# EAGLE design Thermo_Coaster_Schematic (EAGLE 9.5.2)
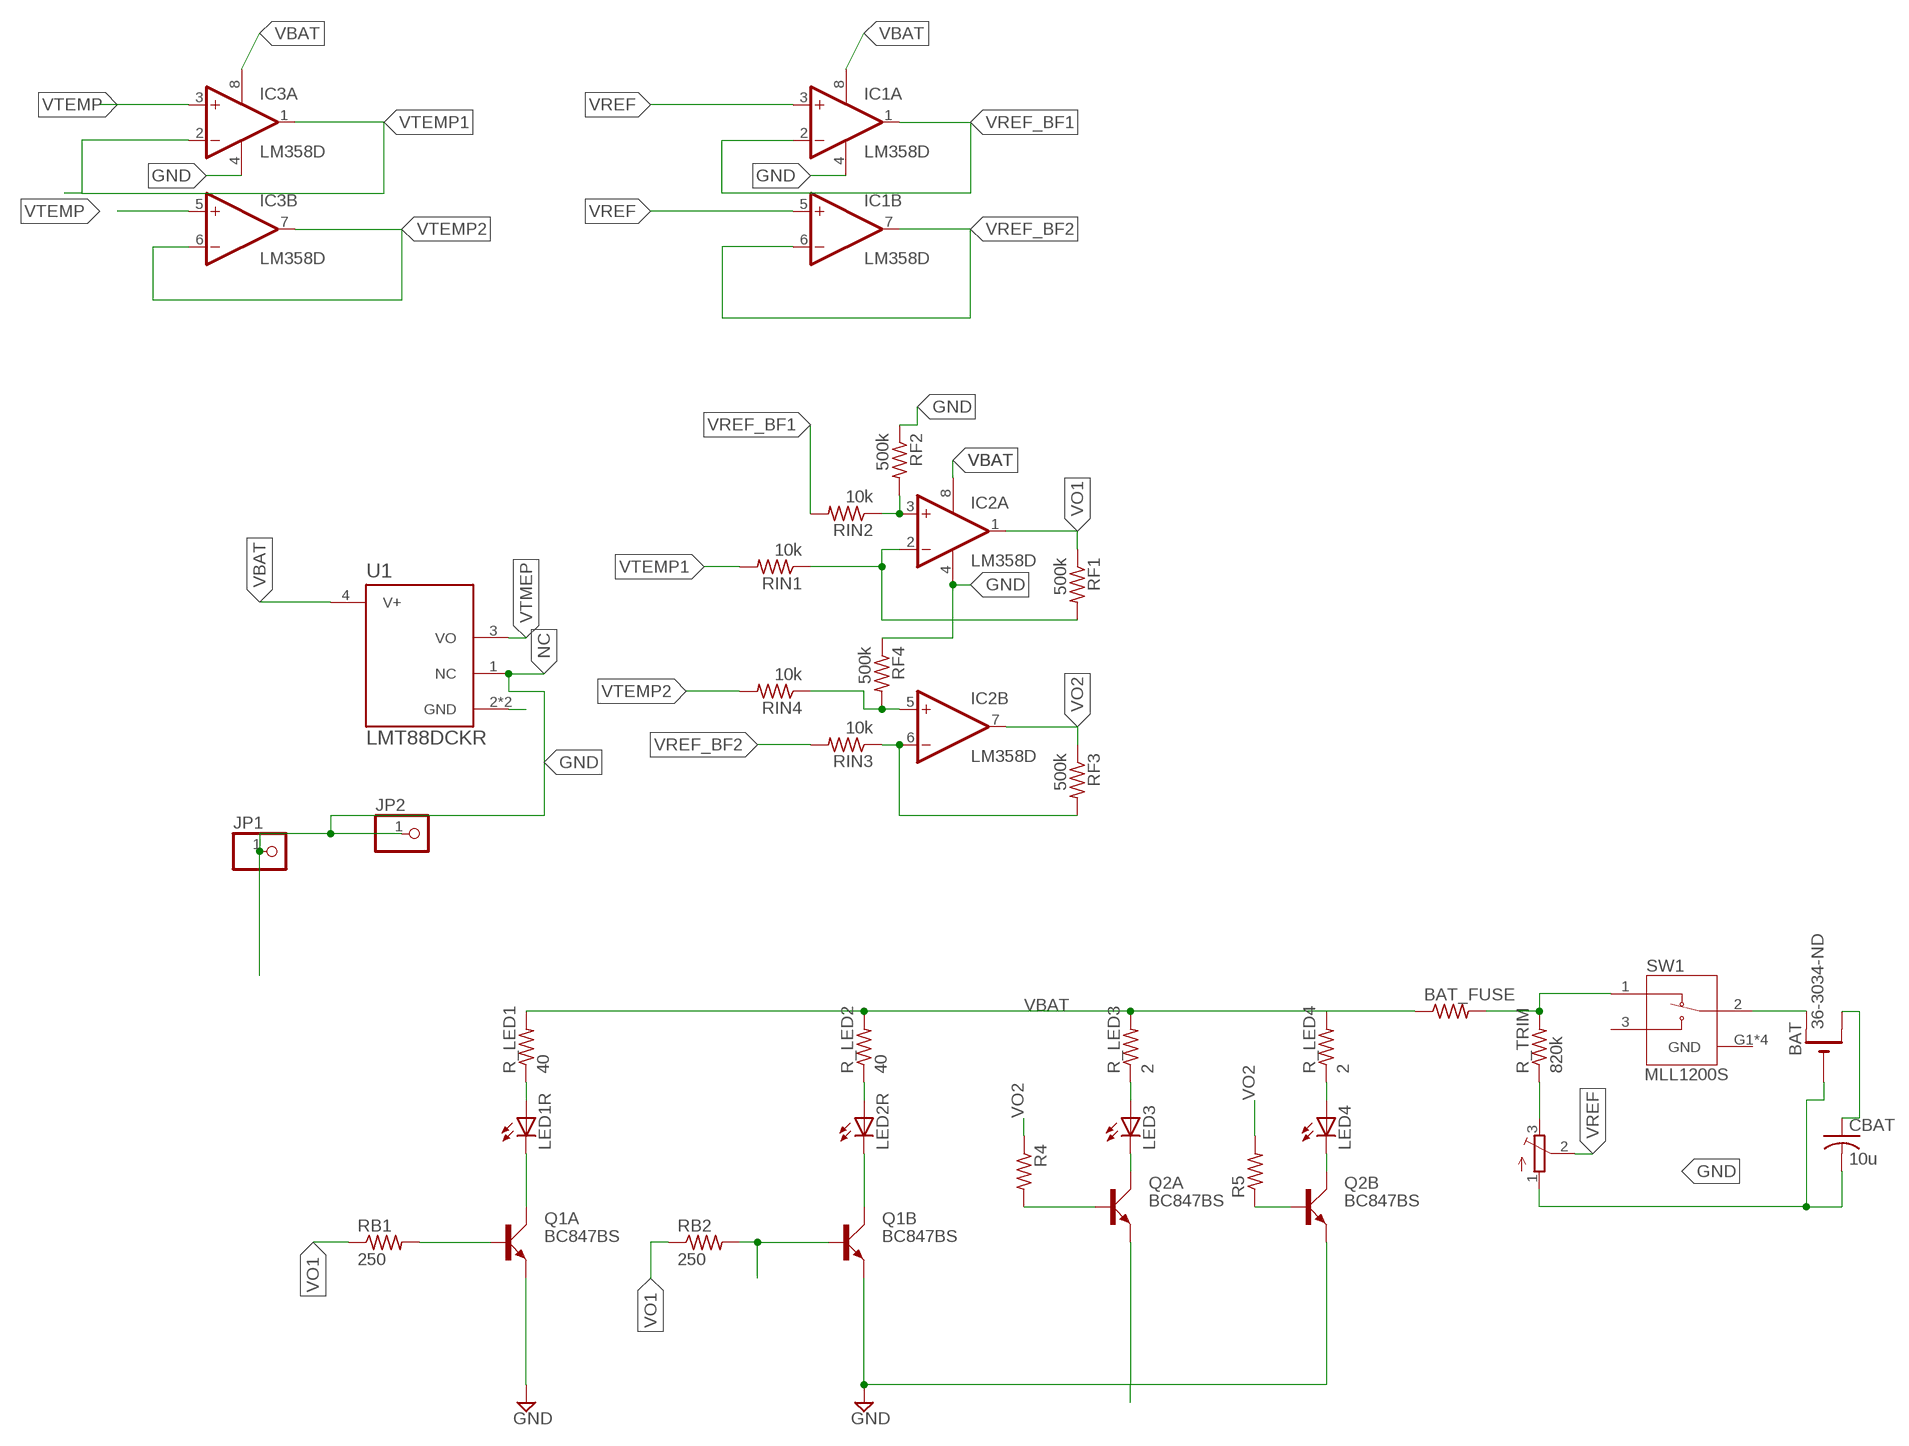
[diagram p0: schematic, sheet 1]

## Parts
BAT  CR1220SMT  [CR1220-SMD]
BAT_FUSE  R-US_R1206  [R1206]
CBAT  10u  C-USC1206  [C1206]
IC1  LM358D  [SO08]
IC2  LM358D  [SO08]
IC3  LM358D  [SO08]
JP1  PINHD-1X1  [1X01]
JP2  PINHD-1X1  [1X01]
LED1R  LEDCHIPLED_1206  [CHIPLED_1206]
LED2R  LEDCHIPLED_1206  [CHIPLED_1206]
LED3  LEDCHIPLED_1206  [CHIPLED_1206]
LED4  LEDCHIPLED_1206  [CHIPLED_1206]
Q1  BC847BS  [SOT363_PHILIPS]
Q2  BC847BS  [SOT363_PHILIPS]
R4  R-US_R0805  [R0805]
R5  R-US_R0805  [R0805]
R_LED1  40  R-US_R0805  [R0805]
R_LED2  40  R-US_R0805  [R0805]
R_LED3  2  R-US_R0805  [R0805]
R_LED4  2  R-US_R0805  [R0805]
R_TRIM  820k  R-US_R0805  [R0805]
RB1  250  R-US_R0805  [R0805]
RB2  250  R-US_R0805  [R0805]
RF1  500k  R-US_R0805  [R0805]
RF2  500k  R-US_R0805  [R0805]
RF3  500k  R-US_R0805  [R0805]
RF4  500k  R-US_R0805  [R0805]
RIN1  10k  R-US_R0805  [R0805]
RIN2  10k  R-US_R0805  [R0805]
RIN3  10k  R-US_R0805  [R0805]
RIN4  10k  R-US_R0805  [R0805]
SW1  MLL1200S  [SW_MLL1200S]
TRIM_VREF  TRIMPOTTC33X  [TC33X]
U1  LMT88DCKR  [SOT65P210X110-5N]

## Nets
GND: BAT.- CBAT.2 IC1.4(P:V-) IC2.4(P:V-) IC3.4(P:V-) Q1.1(A:E) Q1.4(B:E) Q2.1(A:E) Q2.4(B:E) RF2.1 RF4.1 TRIM_VREF.1(A) U1.2(GND) U1.5(GND)
N$1: Q1.2(A:B) RB1.2
N$2: BAT_FUSE.2 R_TRIM.2 SW1.1
N$3: LED2R.A R_LED2.1
N$4: Q1.5(B:B) RB2.2
N$5: LED1R.A R_LED1.1
N$6: LED1R.C Q1.6(A:C)
N$7: LED2R.C Q1.3(B:C)
N$8: LED3.A R_LED3.1
N$9: BAT.+$2(+1) CBAT.1
N$10: IC2.3(A:+IN) RF2.2 RIN2.1
N$11: LED4.A R_LED4.1
N$12: LED3.C Q2.6(A:C)
N$13: BAT.+$1(+) SW1.2
N$14: LED4.C Q2.3(B:C)
N$15: R_TRIM.1 TRIM_VREF.3(E)
N$16: IC2.2(A:-IN) RF1.2 RIN1.1
N$17: IC2.6(B:-IN) RF3.2 RIN3.1
N$18: IC2.5(B:+IN) RF4.2 RIN4.1
NC: JP1.1 JP2.1 U1.1(NC)
VBAT: BAT_FUSE.1 IC1.8(P:V+) IC2.8(P:V+) IC3.8(P:V+) R_LED1.2 R_LED2.2 R_LED3.2 R_LED4.2 U1.4(V+)
VO1: IC2.1(A:OUT) RB1.1 RB2.1 RF1.1
VO2: IC2.7(B:OUT) Q2.2(A:B) Q2.5(B:B) R4.1 R4.2 R5.1 R5.2 RF3.1
VREF: IC1.3(A:+IN) IC1.5(B:+IN) TRIM_VREF.2(S)
VREF_BF1: IC1.1(A:OUT) IC1.2(A:-IN) RIN2.2
VREF_BF2: IC1.6(B:-IN) IC1.7(B:OUT) RIN3.2
VTEMP: IC3.3(A:+IN) IC3.5(B:+IN)
VTEMP1: IC3.1(A:OUT) IC3.2(A:-IN) RIN1.2
VTEMP2: IC3.6(B:-IN) IC3.7(B:OUT) RIN4.2
VTMEP: U1.3(VO)
Unconnected: SW1.3

## Power pins joined to a net without a drawn wire
GND: SW1.G1(GND) SW1.G2(GND) SW1.G3(GND) SW1.G4(GND)

## Library data of the parts
BAT = adafruit:CR1220: CR1216/CR1220/CR1225 12mm 3V lithium coin cell Great for battery packup. Both SMT and THM holders. Note the THM package has the ground pads on both sides of the PCB so that the masks are the same - this reduces the cost; P#: 36-3034-ND
BAT_FUSE R4 R5 R_LED1-R_LED4 R_TRIM RB1 RB2 RF1-RF4 RIN1-RIN4 = adafruit:R-US_: RESISTOR, American symbol
CBAT = adafruit:C-US: CAPACITOR, American symbol
IC1-IC3 = linear:LM358: OP AMP also LM158; LM258; LM2904 Source: http://cache.national.com/ds/LM/LM158.pdf
JP1 JP2 = adafruit:PINHD-1X1: Pin header 1x1 for 0.1" spacing With round pins
LED1R = adafruit:LED: LED OSRAM: - CHIPLED LG R971, LG N971, LY N971, LG Q971, LY Q971, LO R971, LY R971 LH N974, LH R974 LS Q976, LO Q976, LY Q976 LO Q996 - Hyper CHIPLED LW Q18S LB Q993, LB Q99A, LB R99A - SideLED LS A670, LO A670, LY A670, LG A670, LP A670 LB A673, LV A673, LT A673, LW A673 LH A674 LY A675 LS A676, LA A676, LO A676, LY A676, LW A676 LS A679, LY A679, LG A679 - Hyper Micro SIDELED® LS Y876, LA Y876, LO Y876, LY Y876 LT Y87S - SmartLED LW L88C, LW L88S LB L89C, LB L89S, LG L890 LS L89K, LO L89K, LY L89K LS L896, LA L896, LO L896, LY L896 - TOPLED LS T670, LO T670, LY T670, LG T670, LP T670 LSG T670, LSP T670, LSY T670, LOP T670, LYG T670 LG T671, LOG T671, LSG T671 LB T673, LV T673, LT T673, LW T673 LH T674 LS T676, LA T676, LO T676, LY T676, LB T676, LH T676, LSB T676, LW T676 LB T67C, LV T67C, LT T67C, LS T67K, LO T67K, LY T67K, LW E67C LS E67B, LA E67B, LO E67B, LY E67B, LB E67C, LV E67C, LT E67C LW T67C LS T679, LY T679, LG T679 LS T770, LO T770, LY T770, LG T770, LP T770 LB T773, LV T773, LT T773, LW T773 LH T774 LS E675, LA E675, LY E675, LS T675 LS T776, LA T776, LO T776, LY T776, LB T776 LHGB T686 LT T68C, LB T68C - Hyper Mini TOPLED® LB M676 - Mini TOPLED Santana® LG M470 LS M47K, LO M47K, LY M47K Source: http://www.osram.convergy.de/; P#: QBLP615-R
LED2R = adafruit:LED: LED OSRAM: - CHIPLED LG R971, LG N971, LY N971, LG Q971, LY Q971, LO R971, LY R971 LH N974, LH R974 LS Q976, LO Q976, LY Q976 LO Q996 - Hyper CHIPLED LW Q18S LB Q993, LB Q99A, LB R99A - SideLED LS A670, LO A670, LY A670, LG A670, LP A670 LB A673, LV A673, LT A673, LW A673 LH A674 LY A675 LS A676, LA A676, LO A676, LY A676, LW A676 LS A679, LY A679, LG A679 - Hyper Micro SIDELED® LS Y876, LA Y876, LO Y876, LY Y876 LT Y87S - SmartLED LW L88C, LW L88S LB L89C, LB L89S, LG L890 LS L89K, LO L89K, LY L89K LS L896, LA L896, LO L896, LY L896 - TOPLED LS T670, LO T670, LY T670, LG T670, LP T670 LSG T670, LSP T670, LSY T670, LOP T670, LYG T670 LG T671, LOG T671, LSG T671 LB T673, LV T673, LT T673, LW T673 LH T674 LS T676, LA T676, LO T676, LY T676, LB T676, LH T676, LSB T676, LW T676 LB T67C, LV T67C, LT T67C, LS T67K, LO T67K, LY T67K, LW E67C LS E67B, LA E67B, LO E67B, LY E67B, LB E67C, LV E67C, LT E67C LW T67C LS T679, LY T679, LG T679 LS T770, LO T770, LY T770, LG T770, LP T770 LB T773, LV T773, LT T773, LW T773 LH T774 LS E675, LA E675, LY E675, LS T675 LS T776, LA T776, LO T776, LY T776, LB T776 LHGB T686 LT T68C, LB T68C - Hyper Mini TOPLED® LB M676 - Mini TOPLED Santana® LG M470 LS M47K, LO M47K, LY M47K Source: http://www.osram.convergy.de/; P#: 1516-1072-2-ND; SPICEPREFIX: D; URL: https://www.digikey.ca/en/products/detail/qt-brightek-qtb/QBLP615-IB/4814799
LED3 LED4 = adafruit:LED: LED OSRAM: - CHIPLED LG R971, LG N971, LY N971, LG Q971, LY Q971, LO R971, LY R971 LH N974, LH R974 LS Q976, LO Q976, LY Q976 LO Q996 - Hyper CHIPLED LW Q18S LB Q993, LB Q99A, LB R99A - SideLED LS A670, LO A670, LY A670, LG A670, LP A670 LB A673, LV A673, LT A673, LW A673 LH A674 LY A675 LS A676, LA A676, LO A676, LY A676, LW A676 LS A679, LY A679, LG A679 - Hyper Micro SIDELED® LS Y876, LA Y876, LO Y876, LY Y876 LT Y87S - SmartLED LW L88C, LW L88S LB L89C, LB L89S, LG L890 LS L89K, LO L89K, LY L89K LS L896, LA L896, LO L896, LY L896 - TOPLED LS T670, LO T670, LY T670, LG T670, LP T670 LSG T670, LSP T670, LSY T670, LOP T670, LYG T670 LG T671, LOG T671, LSG T671 LB T673, LV T673, LT T673, LW T673 LH T674 LS T676, LA T676, LO T676, LY T676, LB T676, LH T676, LSB T676, LW T676 LB T67C, LV T67C, LT T67C, LS T67K, LO T67K, LY T67K, LW E67C LS E67B, LA E67B, LO E67B, LY E67B, LB E67C, LV E67C, LT E67C LW T67C LS T679, LY T679, LG T679 LS T770, LO T770, LY T770, LG T770, LP T770 LB T773, LV T773, LT T773, LW T773 LH T774 LS E675, LA E675, LY E675, LS T675 LS T776, LA T776, LO T776, LY T776, LB T776 LHGB T686 LT T68C, LB T68C - Hyper Mini TOPLED® LB M676 - Mini TOPLED Santana® LG M470 LS M47K, LO M47K, LY M47K Source: http://www.osram.convergy.de/
Q1 Q2 = transistor-small-signal:BC847BS: NPN general purpose double transistor Source: http://www.farnell.com/datasheets/2466.pdf
SW1 = MLL1200S:MLL1200S: Switch Slide SPDT Side Slide 0.3A 4VDC Gull Wing SMD Box Check prices <https://pricing.snapeda.com/parts/MLL1200S/TE%20Connectivity/view-part?ref=eda>; AVAILABILITY: Good; COMMENT: 1437575-1; DESCRIPTION: Slide Switch SPDT Surface Mount, Right Angle; MF: TE Connectivity; MP: MLL1200S; PACKAGE: None; PRICE: None; PURCHASE-URL: https://pricing.snapeda.com/search/part/MLL1200S/?ref=eda
TRIM_VREF = adafruit:TRIMPOT: SMT trimmer potentiometer part number TC33X http://www.ladyada.net/library/eagle
U1 = LMT88DCKR:LMT88DCKR: ±4°C analog output temperature sensor, with -11.77mV/°C gain 5-SC70 -55 to 130 Check prices <https://pricing.snapeda.com/parts/LMT88DCKR/Texas%20Instruments/view-part?ref=eda>; AVAILABILITY: Good; DESCRIPTION: &plusmn;4&deg;C analog output temperature sensor, with -11.77mV/&deg;C gain 5-SC70 -55 to 130; MF: Texas Instruments; MP: LMT88DCKR; PACKAGE: SOT-SC70-5 Texas Instruments; PRICE: None; PURCHASE-URL: https://pricing.snapeda.com/search/part/LMT88DCKR/?ref=eda

## Net classes
0 default: width 0.002 mm, clearance 0.002 mm

## Board
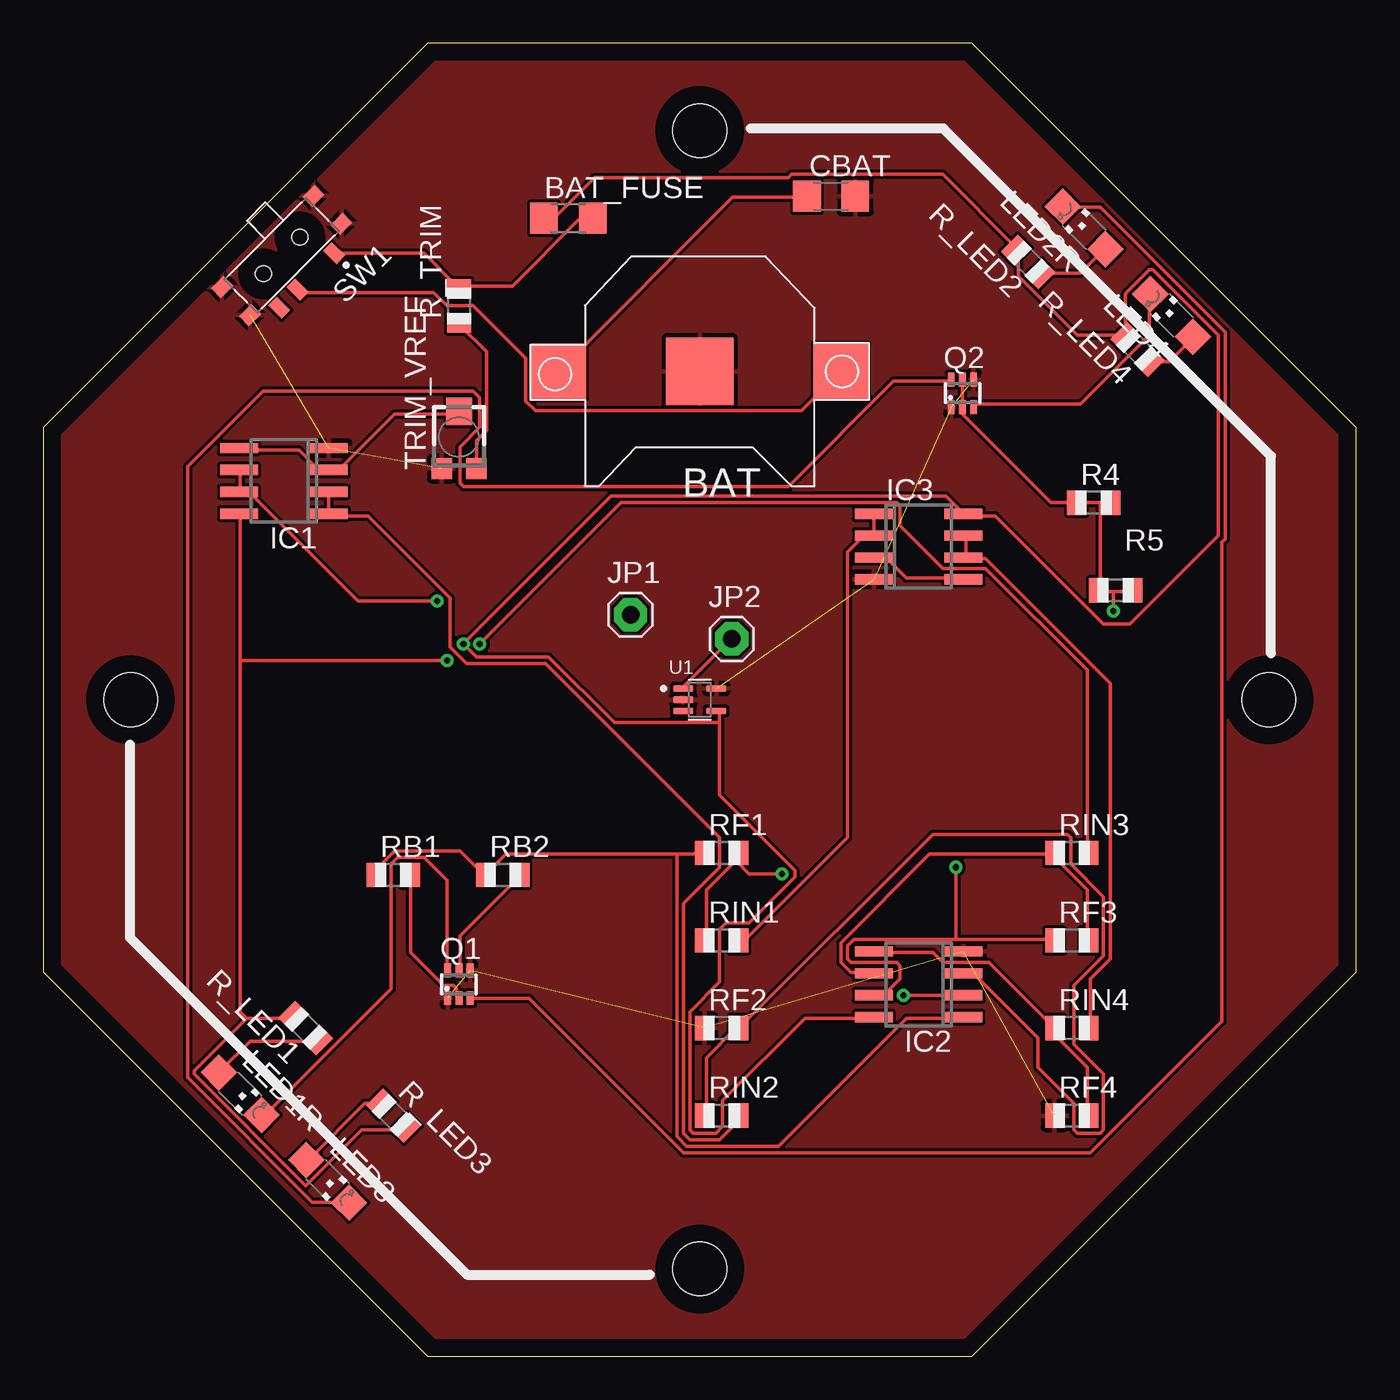
[diagram p1: board, top side]
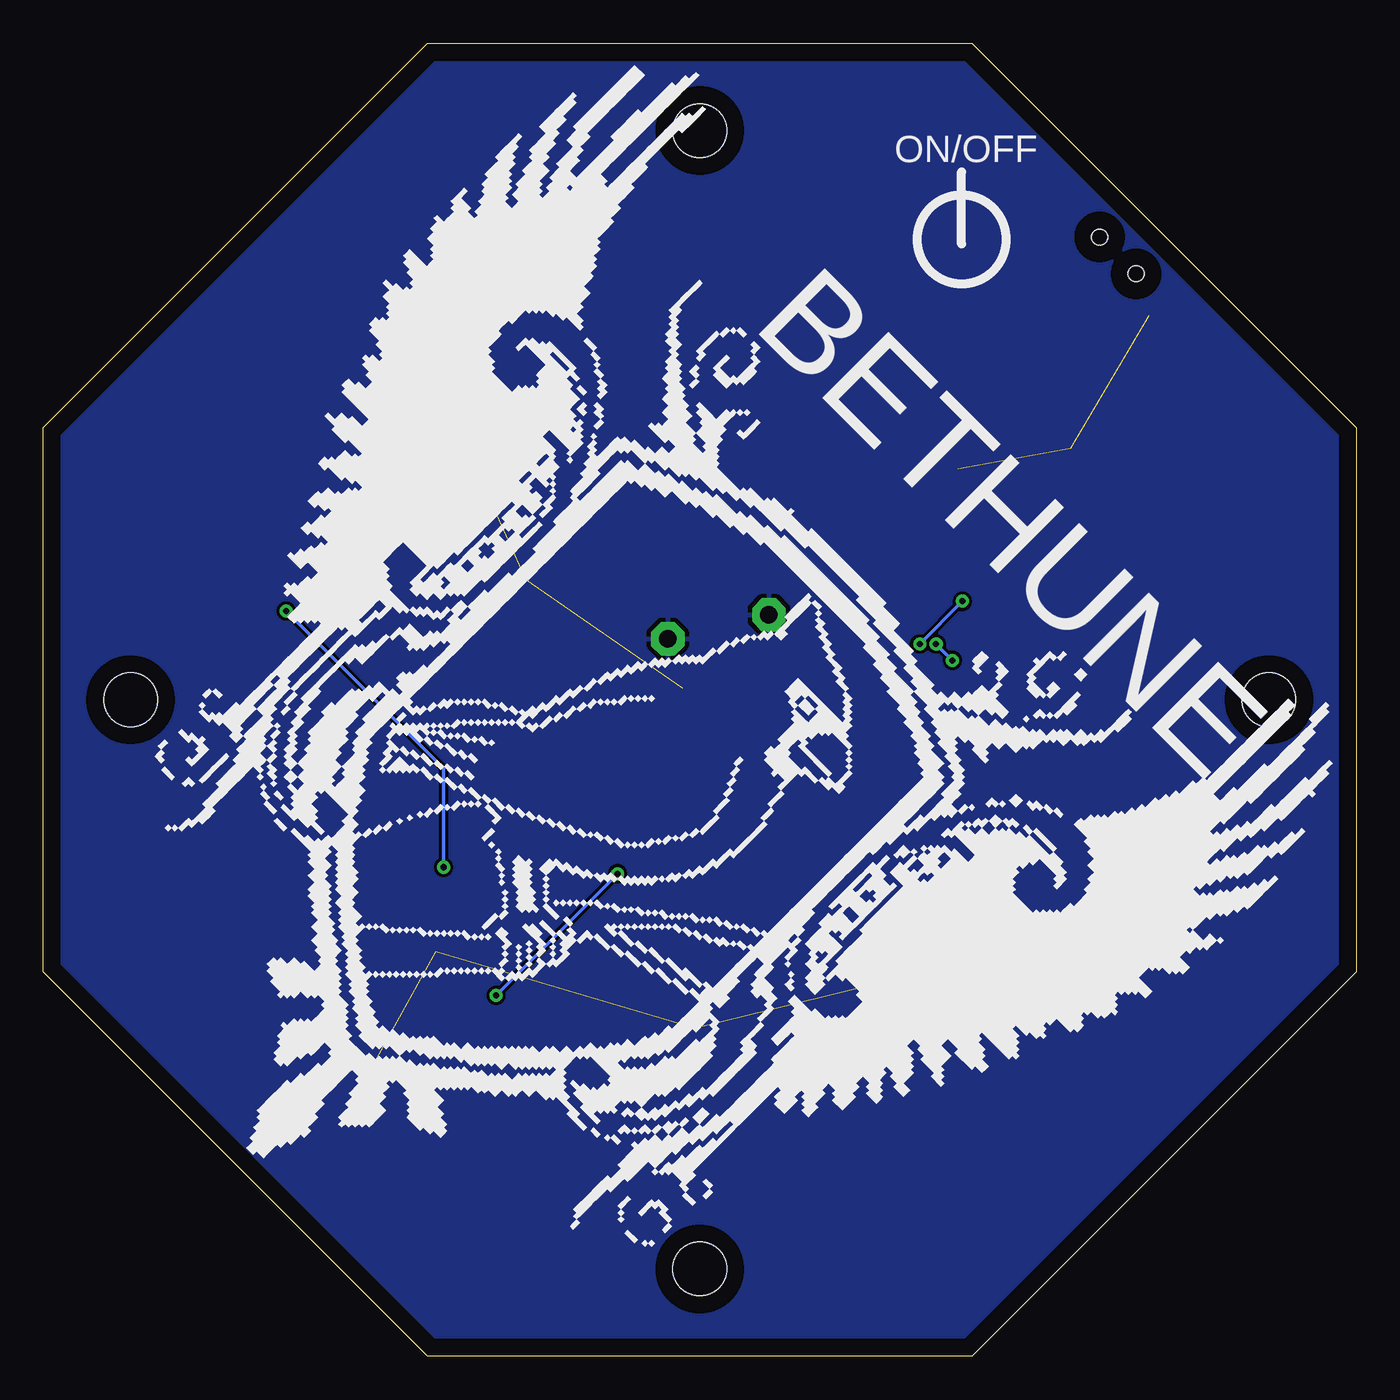
[diagram p2: board, bottom side, seen from below]

Size 76.2 x 76.2 mm. Coordinates in mm from the lower left corner, seen from the top.
Outline: 76.2,53.88 53.88,76.2 22.32,76.2 0,53.88 0,22.32 22.32,0 53.88,0 76.2,22.32 76.2,53.88
Copper layers (1*16): Top 0.035mm / dielectric 1.5mm / Bottom 0.035mm
Design rules "default *": minimum track width 8mil, minimum drill 0.35mm, track to track 7mil, track to pad 7mil, pad to pad 7mil, via to via 7mil, smd to smd 7mil, copper to edge 40mil, drill to drill 6mil, minimum pad ring 10mil, minimum via ring 8mil, stop-mask expansion 4mil, vias tented up to drill 0mil, thermal gap 10mil
Holes 3.11 mm at 71.12,38.1 38.1,71.12 5.08,38.1 38.1,5.08

### Footprints (pad centres in the part's own frame; a part is rotated, then mirrored left to right if it is on the bottom)
CR1220-SMD = smd 3.2 x 3.2: +$1 -8.2,0; +$2 8.2,0 | smd 3.9 x 3.9: - 0,0
R1206 = smd 1.6 x 1.803: 1 -1.422,0; 2 1.422,0
C1206 = smd 1.6 x 1.8: 1 -1.4,0; 2 1.4,0
SO08 = smd 0.6 x 2.2: 1 -1.905,-2.6; 2 -0.635,-2.6; 3 0.635,-2.6; 4 1.905,-2.6; 5 1.905,2.6; 6 0.635,2.6; 7 -0.635,2.6; 8 -1.905,2.6
1X01 = drill 1.016 pad 1.93 octagon: 1 0,0
CHIPLED_1206 = smd 1.5 x 1.5: A 0,-1.75; C 0,1.75
SOT363_PHILIPS = smd 0.4 x 0.8: 1 -0.65,-0.8; 2 0,-0.8; 3 0.65,-0.8; 4 0.65,0.8; 5 0,0.8; 6 -0.65,0.8
R0805 = smd 1.1 x 1.4: 1 -1,0; 2 1,0
SW_MLL1200S = smd 0.7 x 1.1: 1 -2.25,2.05; 2 0.75,2.05; 3 2.25,2.05 | smd 1 x 0.8: G1 -3.75,1.15; G2 3.75,1.15; G3 -3.75,-1.15; G4 3.75,-1.15 | hole 0.9: -1.5,0; 1.5,0
TC33X = smd 1.2 x 1.2: 1 -1,-1.825; 3 1,-1.825 | smd 1.5 x 1.6: 2 0,1.5
SOT65P210X110-5N = smd 1.19 x 0.4: 1 -0.96,0.65; 2 -0.96,0; 3 -0.96,-0.65; 4 0.96,-0.65; 5 0.96,0.65

### Placement (x,y rotation side)
BAT  38.1,57.15 180 top
BAT_FUSE  30.48,66.04 0 top
CBAT  45.72,67.31 0 top
IC1  13.97,50.8 90 top
IC2  50.8,21.59 90 top
IC3  50.8,46.99 270 top
JP1  34.09,43.03 0 top
JP2  39.95,41.63 0 top
LED1R  11.43,15.24 225 top
LED2R  60.4,65.48 45 top
LED3  16.51,10.16 225 top
LED4  65.48,60.4 45 top
Q1  24.13,21.59 0 top
Q2  53.34,55.88 0 top
R4  60.96,49.53 0 top
R5  62.23,44.45 0 top
R_LED1  15.24,19.05 135 top
R_LED2  57.15,63.5 135 top
R_LED3  20.32,13.97 315 top
R_LED4  63.5,58.42 135 top
R_TRIM  24.13,60.96 90 top
RB1  20.32,27.94 0 top
RB2  26.67,27.94 0 top
RF1  39.37,29.21 0 top
RF2  39.37,19.05 0 top
RF3  59.69,24.13 0 top
RF4  59.69,13.97 0 top
RIN1  39.37,24.13 0 top
RIN2  39.37,13.97 0 top
RIN3  59.69,29.21 0 top
RIN4  59.69,19.05 0 top
SW1  13.84,63.88 225 top
TRIM_VREF  24.13,53.34 0 top
U1  38.1,38.1 0 top

### Tracks (layer width: path | path; a pad name or v marks a point on that pad's centre or on a via)
GND  (9 unrouted)
  pour Top: -1.27,29.21 -3.81,26.67 -3.81,-3.81 101.6,-3.81 101.6,74.93 96.52,80.01 7.62,80.01 -1.27,71.12
N$1
  Top 0.203: Q1.2 24,20.95 24,21.34 23.81,21.53 23.24,21.53 21.34,23.43 21.34,27.81 RB1.2
N$2
  Top 0.203: SW1.1 16.95,64.01 22.1,64.01 24,62.1 R_TRIM.2 24.19,62.1 27.24,62.1 31.05,65.91 31.81,65.91 BAT_FUSE.2
N$3
  Top 0.203: R_LED2.1 57.91,62.87 60.2,62.87 61.53,64.2 LED2R.A
N$4
  Top 0.203: Q1.5 24.19,22.48 24.19,24.38 27.62,27.81 RB2.2
N$5
  Top 0.203: R_LED1.1 15.81,18.29 12,18.29 10.29,16.57 LED1R.A
N$6
  Top 0.203: Q1.6 23.43,22.48 23.43,27.62 22.1,28.96 20.57,28.96 20.19,28.57 20.19,21.34 12.76,13.91 LED1R.C
N$7
  Top 0.203: Q1.3 24.96,20.77 28.19,20.77 37.15,11.81 60.77,11.81 68.39,19.43 68.39,47.24 68.58,47.43 68.58,59.44 61.34,66.67 59.24,66.67 LED2R.C
N$8
  Top 0.203: R_LED3.1 19.43,14.67 18.67,14.67 15.43,11.43 LED3.A
N$9
  Top 0.203: CBAT.1 44.2,67.25 40.01,67.25 BAT.+$2
N$10
  Top 0.203: RIN2.1 38.48,14.1 38.48,17.34 40.2,19.05 RF2.2 40.39,19.05 51.63,30.29 59.44,30.29 59.63,30.1 59.63,28.57 61.53,26.67 61.53,23.24 59.82,21.53 59.82,18.1 61.53,16.38 61.53,13.14 61.34,12.95 60.01,12.95 59.82,13.14 59.82,14.67 57.72,16.76 57.72,18.48 54.1,22.1 53.53,22.1 IC2.3
N$11
  Top 0.203: R_LED4.1 64.39,57.72 65.34,57.72 66.67,59.05 LED4.A
N$12
  Top 0.203: Q2.6 52.58,56.58 49.34,56.58 43.24,50.48 24.38,50.48 24.19,50.67 24.19,52.77 25.34,53.91 25.34,55.63 24.96,56.01 12.76,56.01 8.38,51.63 8.38,16.19 15.62,8.95 17.72,8.95 LED3.C
N$13
  Top 0.203: SW1.2 14.86,61.72 22.67,61.72 23.43,60.96 24.96,60.96 28,57.91 28,55.44 28.57,54.86 44.01,54.86 BAT.+$1
N$14
  Top 0.203: Q2.3 54.1,55.24 60.2,55.24 64.2,59.24 64.2,61.53 LED4.C
N$15
  Top 0.203: TRIM_VREF.3 25.15,51.63 25.15,53.15 25.72,53.72 25.72,58.29 24.19,59.82 R_TRIM.1
N$16  (via drill 0.35)
  Top 0.203: 40.2,28.77 38.48,27.05 38.48,24.19 RIN1.1 | 40.2,28.77 40.2,29.15 RF1.2 40.2,28.77 | v49.91,20.95 IC2.2 | v42.86,28 40.96,28 40.2,28.77
  Bottom 0.203: v42.86,28 v49.91,20.95
N$17
  Top 0.203: RF3.2 60.58,24.19 60.58,27.05 58.86,28.77 58.86,29.15 RIN3.1 58.67,29.15 51.44,29.15 46.29,24 46.29,22.86 46.86,22.29 48.2,22.29 IC2.6
N$18
  Top 0.203: RF4.2 60.58,14.1 60.58,16.76 58.86,18.48 58.86,19.05 RIN4.1 58.67,19.05 54.86,22.86 52.2,22.86 51.63,23.43 48.39,23.43 IC2.5
NC
  Top 0.203: U1.1 37.15,38.86 39.81,41.53 JP2.1
  pour Bottom: 0,0 0,77.47 1.27,78.74 72.39,78.74 73.66,77.47 87.63,63.5 87.63,44.45 87.63,2.54 82.55,-2.54 0,-2.54
VBAT  (via drill 0.35)
  Top 0.203: 11.81,19.62 8.76,16.57 8.76,16.38 15.24,9.91 18.48,13.14 20.95,13.14 R_LED3.2 | 11.81,19.62 14.48,19.62 R_LED1.2 | 11.43,40.39 11.43,20 11.81,19.62 | 11.43,40.39 11.43,48.77 IC1.8 | 39.24,36.77 39.24,32.58 43.62,28.19 43.62,27.81 40.96,25.15 39.62,25.15 39.24,24.77 39.24,21.72 37.53,20 37.53,13.14 37.72,12.95 39.05,12.95 39.43,13.34 39.43,14.86 44.2,19.62 48.2,19.62 IC2.8 | 39.24,36.77 39.24,37.34 U1.4 | BAT_FUSE.1 29.15,66.1 29.72,66.1 32,68.39 43.24,68.39 43.43,68.58 52.2,68.58 56.39,64.39 R_LED2.2 56.58,64.2 56.58,62.67 60.01,59.24 62.67,59.24 R_LED4.2 62.79,61.6 62.87,61.72 64.2,63.06 64.39,63.06 68.2,59.24 68.2,47.62 63.06,42.48 61.53,42.48 55.24,48.77 53.53,48.77 IC3.8 53.34,48.96 52.39,49.91 32.96,49.91 24.57,41.53 24.57,41.34 | 39.24,36.77 33.15,36.77 29.34,40.58 25.15,40.58 24.57,41.15 24.57,41.34 | v23.43,40.39 11.43,40.39 | 24.57,41.34 v24.38,41.34
  Bottom 0.203: v24.38,41.34 v23.43,40.39
VO1
  Top 0.203: RB1.1 19.43,28 19.43,28.38 20.38,29.34 24.19,29.34 25.53,28 RB2.1 25.72,28 26.86,29.15 36.77,29.15 | 36.77,29.15 38.29,29.15 RF1.1 | 36.77,29.15 36.77,12.76 37.34,12.19 42.67,12.19 50.1,19.62 53.34,19.62 IC2.1
VO2  (via drill 0.35)
  Top 0.203: 52.96,24.19 47.05,24.19 46.67,23.81 46.67,23.05 46.86,22.86 49.53,22.86 49.72,22.67 49.72,21.91 48.77,20.95 IC2.7 | 52.96,24.19 58.67,24.19 RF3.1 | 62.1,44.39 63.06,44.39 R5.2 | 62.1,44.39 61.34,44.39 R5.1 61.34,44.58 61.34,49.53 | Q2.5 Q2.2 53.34,54.67 58.48,49.53 R4.1 61.34,49.53 | 61.34,49.53 R4.2 | v52.96,28.38 52.96,24.19 | 62.1,44.39 v62.1,43.24
  Bottom 0.203: v52.96,28.38 52.96,34.1 v62.1,43.24
VREF
  Top 0.203: TRIM_VREF.2 24,54.67 20.38,54.67 17.14,51.44 IC1.3 16,51.44 14.86,52.58 11.43,52.58 IC1.5
VREF_BF1
  Top 0.203: RIN2.2 40.2,13.91 40.2,13.53 39.24,12.57 37.53,12.57 37.15,12.95 37.15,26.29 39.24,28.38 39.24,30.1 29.15,40.2 24.57,40.2 23.62,41.15 23.62,44.01 18.86,48.77 16.57,48.77 IC1.1 16.57,48.96 16.57,50.1 IC1.2
VREF_BF2  (via drill 0.35)
  Top 0.203: v25.34,41.34 33.53,49.53 49.53,49.53 49.72,49.34 49.72,48.2 52.2,45.72 54.67,45.72 60.58,39.81 60.58,29.34 RIN3.2 | v22.86,43.81 18.29,43.81 12,50.1 11.43,50.1 IC1.7 11.43,50.29 11.43,51.44 IC1.6
  Bottom 0.203: v22.86,43.81 v25.34,41.34
VTEMP
  Top 0.203: IC3.5 53.34,45.15 50.1,45.15 48.96,46.29 48.39,46.29 IC3.3
VTEMP1
  Top 0.203: IC3.2 47.62,47.62 46.67,46.67 46.67,30.1 40.77,24.19 40.39,24.19 RIN1.2 | IC3.2 48.2,48.77 IC3.1 | IC3.2
VTEMP2
  Top 0.203: RIN4.2 60.77,19.05 60.77,21.91 61.91,23.05 61.91,39.05 54.67,46.29 53.53,46.29 IC3.6 53.53,46.48 53.53,47.62 IC3.7

### Text on the board
bPlace: ON/OFF | BETHUNE